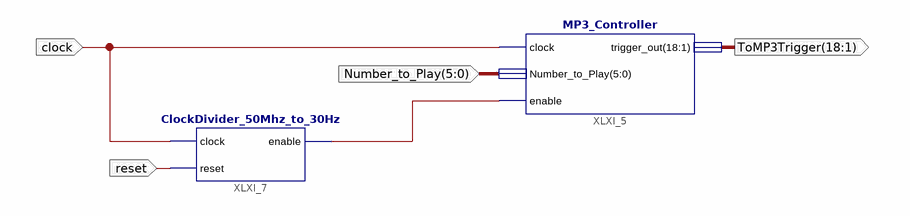
[diagram p0: schematic sheet 1]
// Xilinx ISE schematic MP3Schematic.sch (spartan3e) as structural Verilog: 2 symbols, 4 ports
module MP3Schematic (
  input  [5:0] Number_to_Play,
  input  clock,
  input  reset,
  output [18:1] ToMP3Trigger
);

  wire XLXN_11;

  MP3_Controller XLXI_5 (.clock(clock), .trigger_out(ToMP3Trigger), .enable(XLXN_11), .Number_to_Play(Number_to_Play));
  ClockDivider_50Mhz_to_30Hz XLXI_7 (.clock(clock), .reset(reset), .enable(XLXN_11));
endmodule
